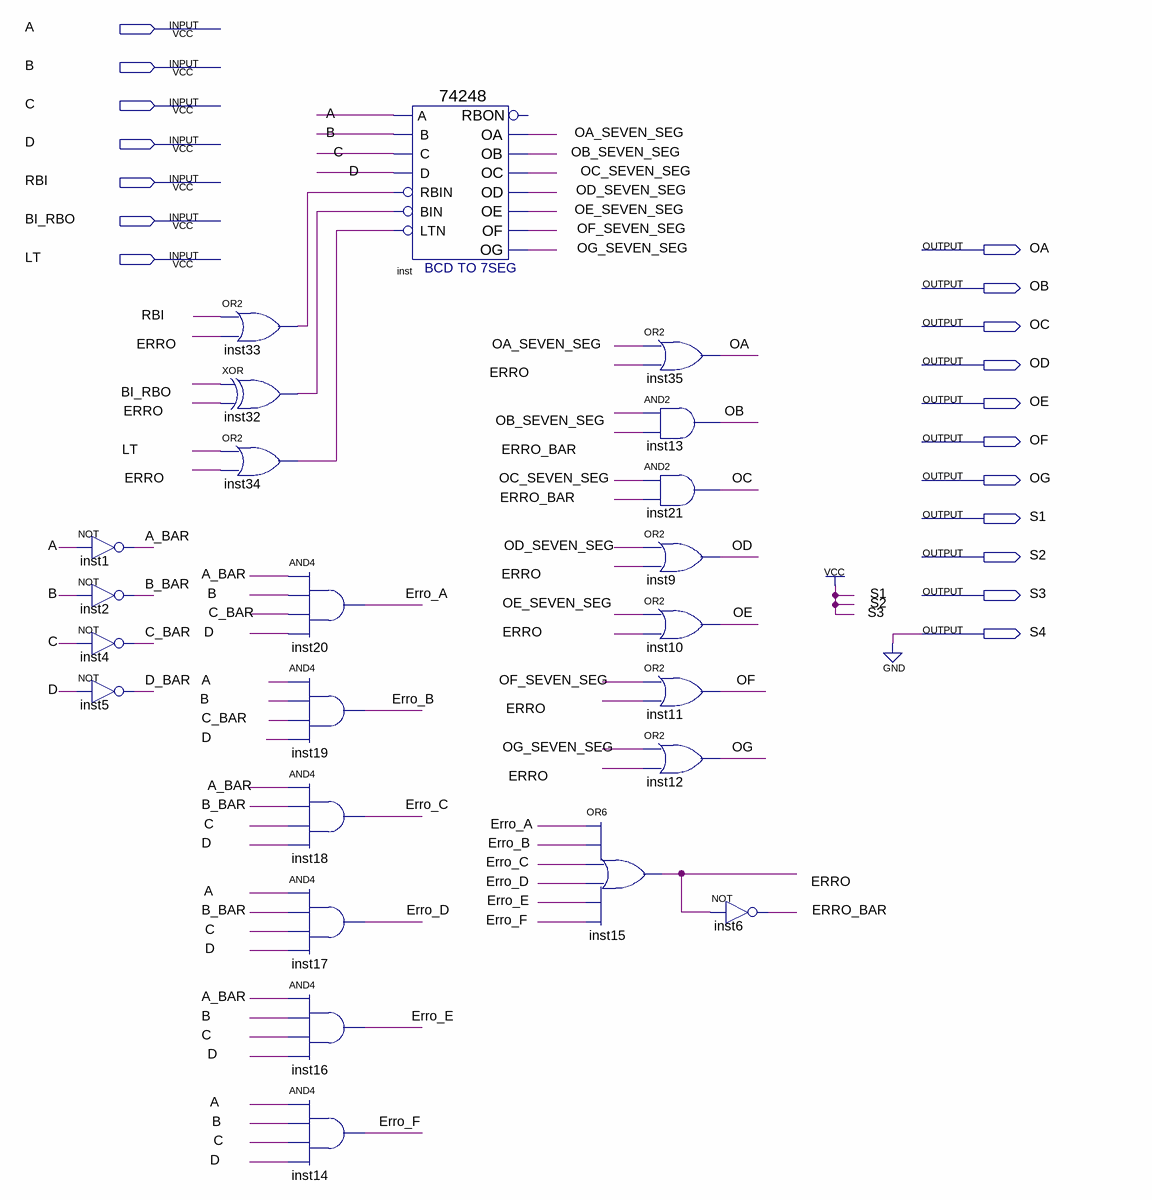
[diagram p0: schematic sheet]
// Quartus schematic BCD_seven_seg_seven_four_two_four_eight_error.bdf as structural Verilog: 23 symbols, 18 pins
module BCD_seven_seg_seven_four_two_four_eight_error (
  input  A,
  input  B,
  input  C,
  input  D,
  input  RBI,
  input  BI_RBO,
  input  LT,
  output OA,
  output OB,
  output OC,
  output OD,
  output OE,
  output OF,
  output OG,
  output S1,
  output S2,
  output S3,
  output S4
);

  wire A_BAR, B_BAR, C_BAR, D_BAR, ERRO, Erro_A, Erro_B, ERRO_BAR, Erro_C, Erro_D, Erro_E, Erro_F,
       inst32_out, inst33_out, inst34_out, OA_SEVEN_SEG, OB_SEVEN_SEG, OC_SEVEN_SEG, OD_SEVEN_SEG,
       OE_SEVEN_SEG, OF_SEVEN_SEG, OG_SEVEN_SEG;

  not inst1 (A_BAR, A);
  not inst2 (B_BAR, B);
  not inst4 (C_BAR, C);
  not inst5 (D_BAR, D);
  or inst33 (inst33_out, RBI, ERRO);
  xor inst32 (inst32_out, BI_RBO, ERRO);
  or inst34 (inst34_out, LT, ERRO);
  and inst20 (Erro_A, A_BAR, B, C_BAR, D);
  and inst19 (Erro_B, A, B, C_BAR, D);
  and inst18 (Erro_C, A_BAR, B_BAR, C, D);
  and inst17 (Erro_D, A, B_BAR, C, D);
  and inst16 (Erro_E, A_BAR, B, C, D);
  and inst14 (Erro_F, A, B, C, D);
  \74248  inst (
    .A(A), .B(B), .RBIN(inst33_out), .D(D), .C(C), .LTN(inst34_out), .BIN(inst32_out), .OG(OG_SEVEN_SEG),
    .OD(OD_SEVEN_SEG), .OE(OE_SEVEN_SEG), .OF(OF_SEVEN_SEG), .OA(OA_SEVEN_SEG), .OB(OB_SEVEN_SEG),
    .OC(OC_SEVEN_SEG));  // open: RBON
  or inst35 (OA, OA_SEVEN_SEG, ERRO);
  and inst13 (OB, OB_SEVEN_SEG, ERRO_BAR);
  and inst21 (OC, OC_SEVEN_SEG, ERRO_BAR);
  or inst9 (OD, OD_SEVEN_SEG, ERRO);
  or inst10 (OE, OE_SEVEN_SEG, ERRO);
  or inst11 (OF, OF_SEVEN_SEG, ERRO);
  or inst12 (OG, OG_SEVEN_SEG, ERRO);
  or inst15 (ERRO, Erro_A, Erro_B, Erro_C, Erro_D, Erro_E, Erro_F);
  not inst6 (ERRO_BAR, ERRO);

  assign S1 = 1'b1;
  assign S2 = 1'b1;
  assign S3 = 1'b1;
  assign S4 = 1'b0;
endmodule
